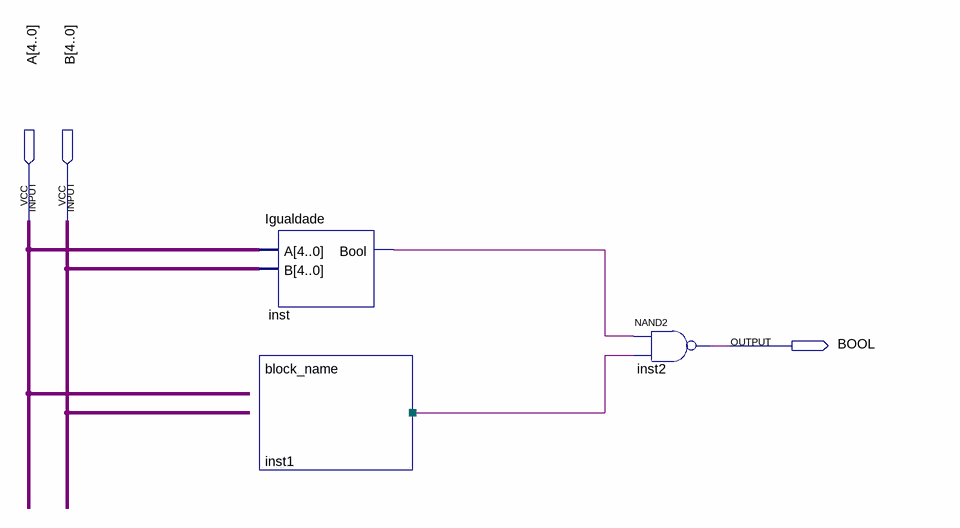
[diagram p0: schematic sheet]
// Quartus schematic MenorQue.bdf as structural Verilog: 3 symbols, 3 pins
module MenorQue (
  input  [4:0] A,
  input  [4:0] B,
  output BOOL
);

  wire inst_bool, undriven;

  Igualdade inst (.A(A), .B(B), .Bool(inst_bool));
  block_name inst1 ();
  nand inst2 (BOOL, inst_bool, undriven);
endmodule
